# Altium schematic sheet output.SchDoc: 230 VAC outputs connector circuit
size A4; Date: 2023-02-11; DocumentNumber: 4; SheetNumber: 4; SheetTotal: 6
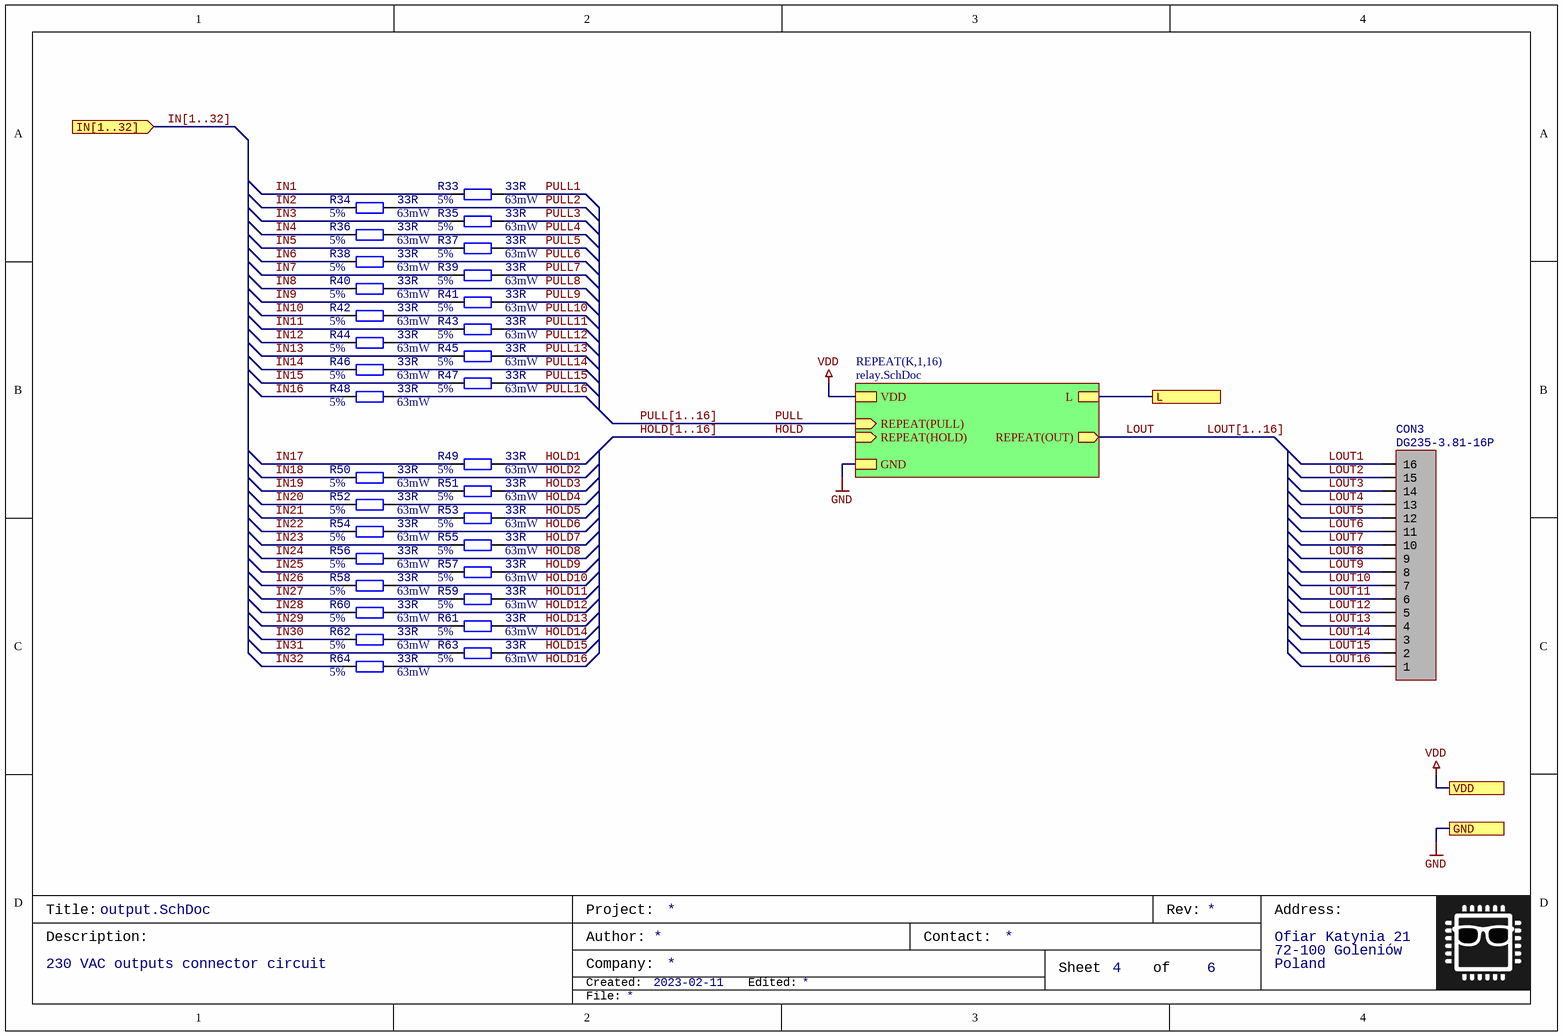
[diagram p0: output.SchDoc]

## Parts
CON3  DG235-3.81-16P  [DG235-3.81-16P]
R33  33R  Power: 63mW  Tolerance: 5%  [RES0603]
R34  33R  Power: 63mW  Tolerance: 5%  [RES0603]
R35  33R  Power: 63mW  Tolerance: 5%  [RES0603]
R36  33R  Power: 63mW  Tolerance: 5%  [RES0603]
R37  33R  Power: 63mW  Tolerance: 5%  [RES0603]
R38  33R  Power: 63mW  Tolerance: 5%  [RES0603]
R39  33R  Power: 63mW  Tolerance: 5%  [RES0603]
R40  33R  Power: 63mW  Tolerance: 5%  [RES0603]
R41  33R  Power: 63mW  Tolerance: 5%  [RES0603]
R42  33R  Power: 63mW  Tolerance: 5%  [RES0603]
R43  33R  Power: 63mW  Tolerance: 5%  [RES0603]
R44  33R  Power: 63mW  Tolerance: 5%  [RES0603]
R45  33R  Power: 63mW  Tolerance: 5%  [RES0603]
R46  33R  Power: 63mW  Tolerance: 5%  [RES0603]
R47  33R  Power: 63mW  Tolerance: 5%  [RES0603]
R48  33R  Power: 63mW  Tolerance: 5%  [RES0603]
R49  33R  Power: 63mW  Tolerance: 5%  [RES0603]
R50  33R  Power: 63mW  Tolerance: 5%  [RES0603]
R51  33R  Power: 63mW  Tolerance: 5%  [RES0603]
R52  33R  Power: 63mW  Tolerance: 5%  [RES0603]
R53  33R  Power: 63mW  Tolerance: 5%  [RES0603]
R54  33R  Power: 63mW  Tolerance: 5%  [RES0603]
R55  33R  Power: 63mW  Tolerance: 5%  [RES0603]
R56  33R  Power: 63mW  Tolerance: 5%  [RES0603]
R57  33R  Power: 63mW  Tolerance: 5%  [RES0603]
R58  33R  Power: 63mW  Tolerance: 5%  [RES0603]
R59  33R  Power: 63mW  Tolerance: 5%  [RES0603]
R60  33R  Power: 63mW  Tolerance: 5%  [RES0603]
R61  33R  Power: 63mW  Tolerance: 5%  [RES0603]
R62  33R  Power: 63mW  Tolerance: 5%  [RES0603]
R63  33R  Power: 63mW  Tolerance: 5%  [RES0603]
R64  33R  Power: 63mW  Tolerance: 5%  [RES0603]

## Sub-sheets
REPEAT(K,1,16) = relay.SchDoc: REPEAT(OUT) (out), L, REPEAT(PULL) (in), REPEAT(HOLD) (in), VDD, GND

## Ports
GND, IN[1..32] (in), L, VDD

## Nets
GND: port GND, sheet REPEAT(K,1,16)/GND
VDD: port VDD, sheet REPEAT(K,1,16)/VDD
HOLD: sheet REPEAT(K,1,16)/REPEAT(HOLD)
HOLD1: R49.2
HOLD2: R50.2
HOLD3: R51.2
HOLD4: R52.2
HOLD5: R53.2
HOLD6: R54.2
HOLD7: R55.2
HOLD8: R56.2
HOLD9: R57.2
HOLD10: R58.2
HOLD11: R59.2
HOLD12: R60.2
HOLD13: R61.2
HOLD14: R62.2
HOLD15: R63.2
HOLD16: R64.2
IN1: R33.1
IN2: R34.1
IN3: R35.1
IN4: R36.1
IN5: R37.1
IN6: R38.1
IN7: R39.1
IN8: R40.1
IN9: R41.1
IN10: R42.1
IN11: R43.1
IN12: R44.1
IN13: R45.1
IN14: R46.1
IN15: R47.1
IN16: R48.1
IN17: R49.1
IN18: R50.1
IN19: R51.1
IN20: R52.1
IN21: R53.1
IN22: R54.1
IN23: R55.1
IN24: R56.1
IN25: R57.1
IN26: R58.1
IN27: R59.1
IN28: R60.1
IN29: R61.1
IN30: R62.1
IN31: R63.1
IN32: R64.1
L: port L, sheet REPEAT(K,1,16)/L
LOUT: sheet REPEAT(K,1,16)/REPEAT(OUT)
LOUT1: CON3.16
LOUT2: CON3.15
LOUT3: CON3.14
LOUT4: CON3.13
LOUT5: CON3.12
LOUT6: CON3.11
LOUT7: CON3.10
LOUT8: CON3.9
LOUT9: CON3.8
LOUT10: CON3.7
LOUT11: CON3.6
LOUT12: CON3.5
LOUT13: CON3.4
LOUT14: CON3.3
LOUT15: CON3.2
LOUT16: CON3.1
PULL: sheet REPEAT(K,1,16)/REPEAT(PULL)
PULL1: R33.2
PULL2: R34.2
PULL3: R35.2
PULL4: R36.2
PULL5: R37.2
PULL6: R38.2
PULL7: R39.2
PULL8: R40.2
PULL9: R41.2
PULL10: R42.2
PULL11: R43.2
PULL12: R44.2
PULL13: R45.2
PULL14: R46.2
PULL15: R47.2
PULL16: R48.2

## Buses and harness runs
bus HOLD[1..16]
bus IN[1..32] = port IN[1..32]
bus LOUT[1..16]
bus PULL[1..16]

## Notes on the sheet
- Title:
- Project:
- Rev:
- Address:
- Description:
- Created:
- Author:
- Company:
- Edited:
- Contact:
- Sheet
- of
- Ofiar Katynia 21
- 72-100 Goleniów
- Poland
- File:

## Library data of the parts
CON3 = DG235-3.81-16P: PCB spring terminal blocks,Rated current:10A.Rated voltage （III/2）:250V,pitch:3.81mm,Color:gray,Contact surface :Tin; Manufacturer: DEGSON ELECTRONICS; Nominal Current: 5A; Identifier: DG235-3.81-16P
R33-R64 = Resistor: Generic resistor symbol; Value: 33R; Manufacturer: *; Identifier: *; Datasheet: *